# Altium schematic sheet PAGE2 -MCU.SchDoc
size A3; DocumentNumber: 1; SheetNumber: 1; SheetTotal: 2
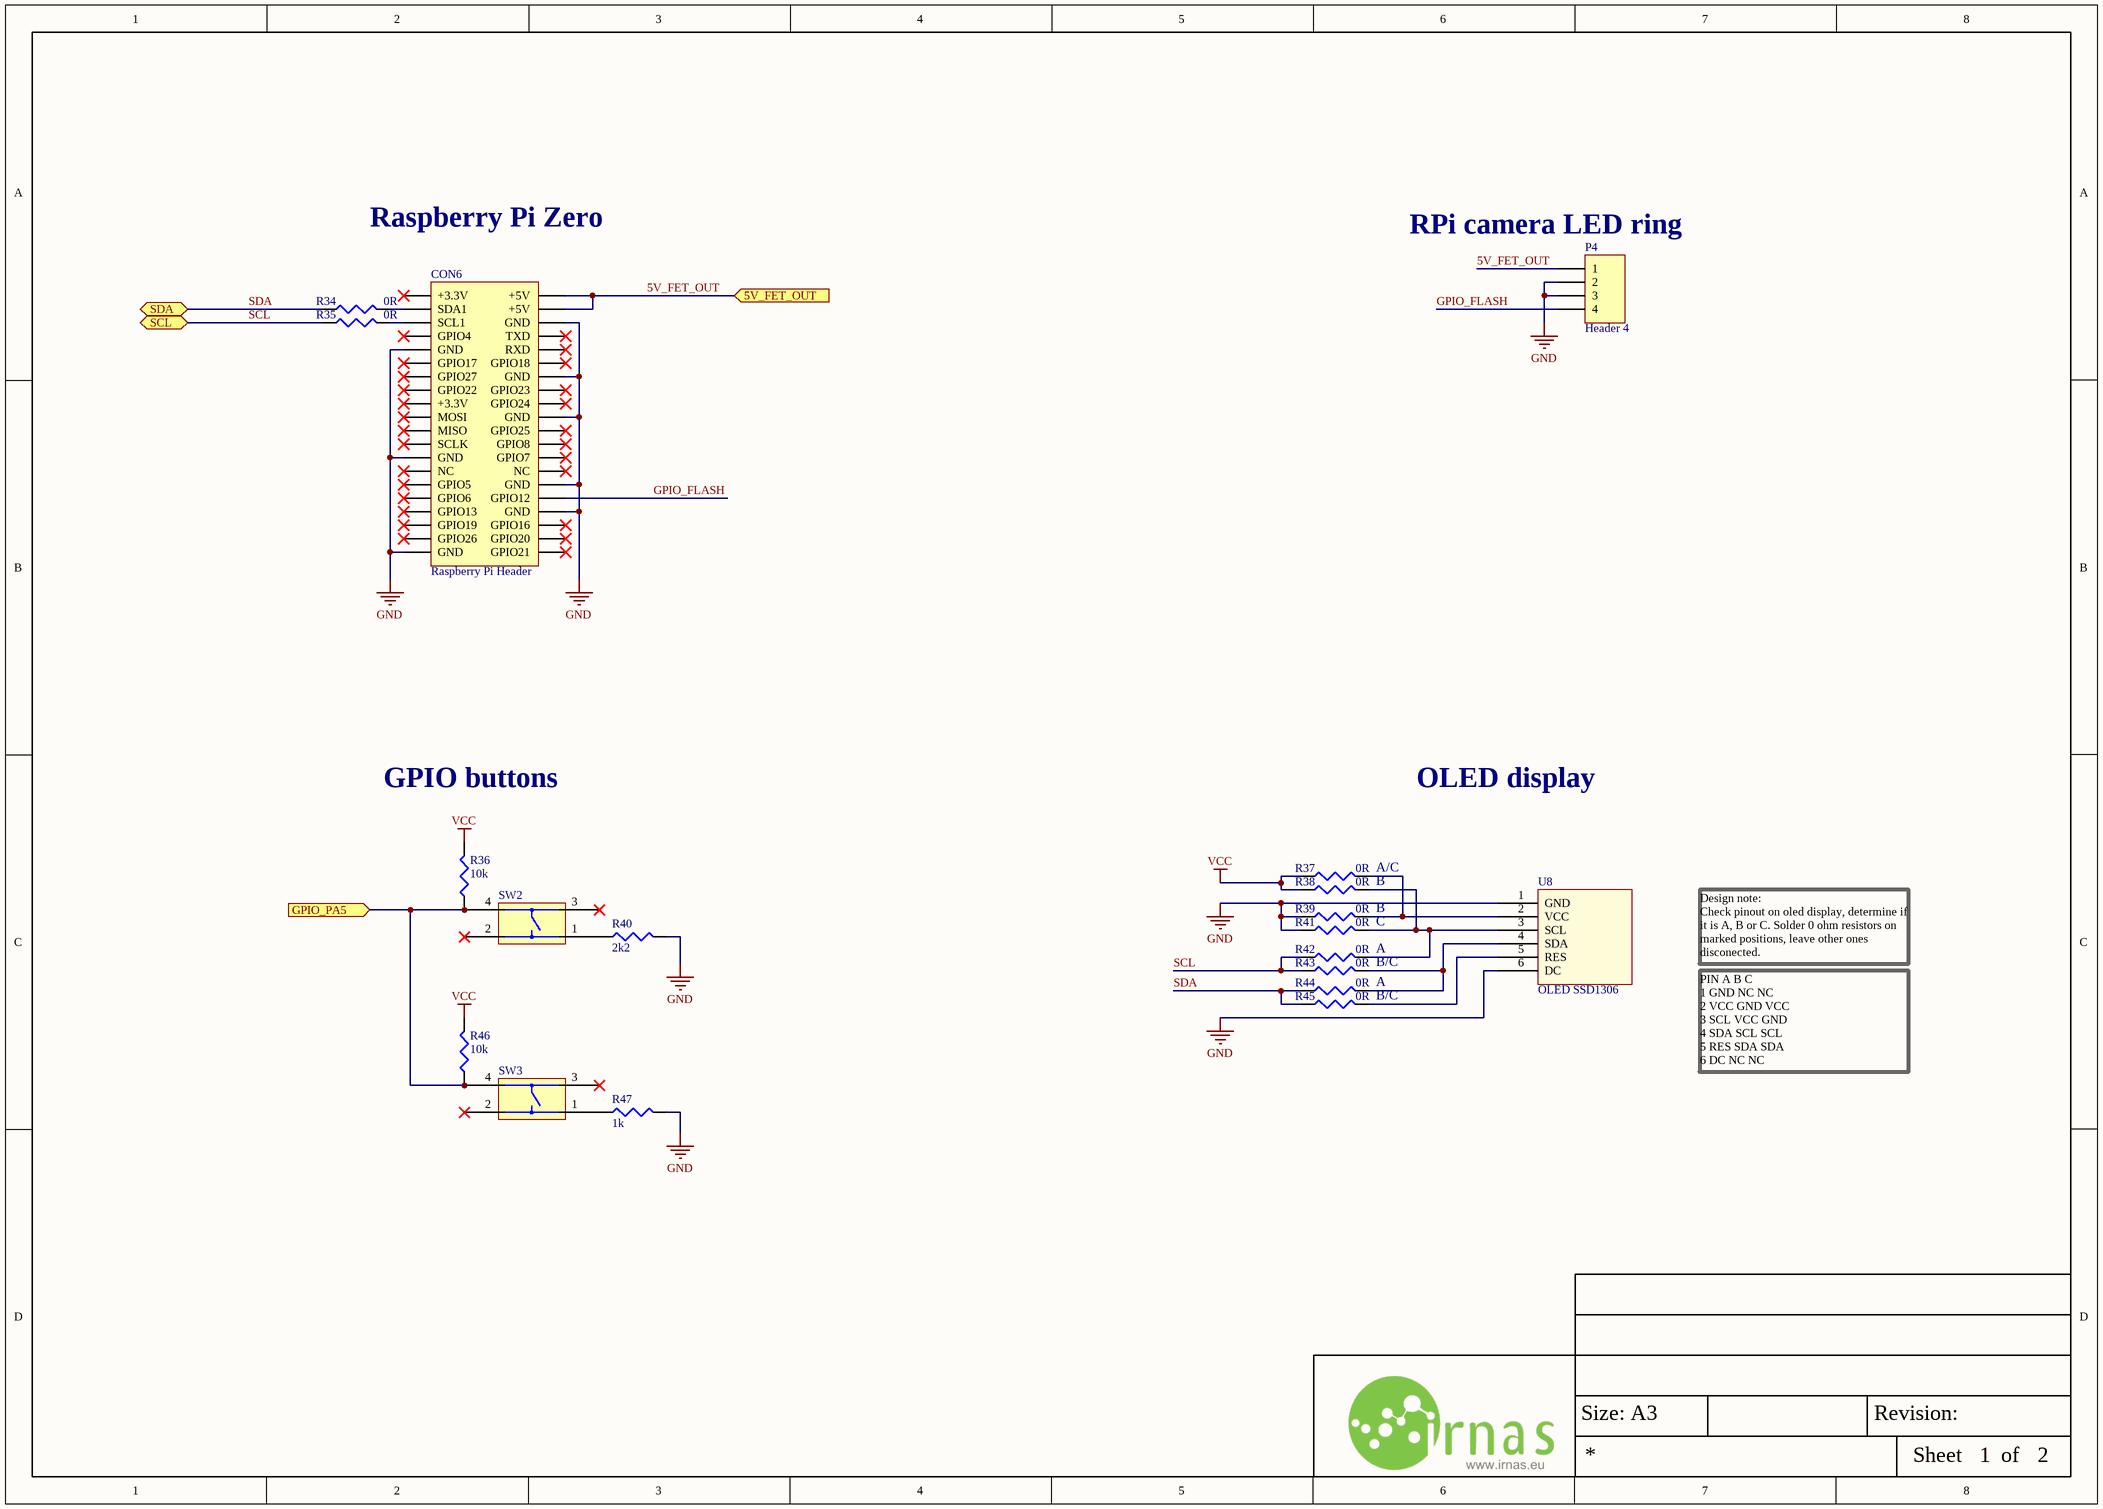
[diagram p0: PAGE2 -MCU.SchDoc]

## Parts
CON6  Raspberry Pi Header  [HDR2X20]
P4  Header 4  [HDR1X4]
R34  0R  [RES0603]
R35  0R  [RES0603]
R36  10k  [RES0603]
R37  0R  [RES0603]
R38  0R  [RES0603]
R39  0R  [RES0603]
R40  2k2  [RES0603]
R41  0R  [RES0603]
R42  0R  [RES0603]
R43  0R  [RES0603]
R44  0R  [RES0603]
R45  0R  [RES0603]
R46  10k  [RES0603]
R47  1k  [RES0603]
SW2  BTN - B3F-1070  [BTN B3F-1070]  (value not drawn)
SW3  BTN - B3F-1070  [BTN B3F-1070]  (value not drawn)
U8  OLED SSD1306  [OLED SSD1306]

## Ports
5V_FET_OUT (in), GPIO_PA5 (in), SCL (bidir), SDA (bidir)

## Nets
GND: CON6.6(GND) CON6.9(GND) CON6.14(GND) CON6.20(GND) CON6.25(GND) CON6.30(GND) CON6.34(GND) CON6.39(GND) P4.2 P4.3 R39.1 R40.2 R41.1 R47.2 U8.1(GND) U8.6(DC)
VCC: R36.2 R37.1 R38.1 R46.2
5V_FET_OUT: CON6.2(+5V) CON6.4(+5V) P4.1 ; port 5V_FET_OUT
GPIO_FLASH: CON6.32(GPIO12) P4.4
GPIO_PA5: R36.1 R46.1 SW2.4 SW3.4 ; port GPIO_PA5
SCL: R35.1 R42.1 R43.1 ; port SCL
SDA: R34.1 R44.1 R45.1 ; port SDA
NetCON6_3: CON6.3(SDA1) R34.2
NetCON6_5: CON6.5(SCL1) R35.2
NetR37_2: R37.2 R39.2 U8.2(VCC)
NetR38_2: R38.2 R41.2 R42.2 U8.3(SCL)
NetR40_1: R40.1 SW2.1
NetR43_2: R43.2 R44.2 U8.4(SDA)
NetR45_2: R45.2 U8.5(RES)
NetR47_1: R47.1 SW3.1

Not connected (* = marked no-connect by the designer): CON6 1(+3.3V)* 7(GPIO4)* 8(TXD)* 10(RXD)* 11(GPIO17)* 12(GPIO18)* 13(GPIO27)* 15(GPIO22)* 16(GPIO23)* 17(+3.3V)* 18(GPIO24)* 19(MOSI)* 21(MISO)* 22(GPIO25)* 23(SCLK)* 24(GPIO8)* 26(GPIO7)* 27(NC)* 28(NC)* 29(GPIO5)* 31(GPIO6)* 33(GPIO13)* 35(GPIO19)* 36(GPIO16)* 37(GPIO26)* 38(GPIO20)* 40(GPIO21)*; SW2 2* 3*; SW3 2* 3*

## Notes on the sheet
- Raspberry Pi Zero
- (near P4) RPi camera LED ring
- GPIO buttons
- OLED display
- A/C
- B
- C
- A
- B/C
- Design note:
  Check pinout on oled display, determine if it is A, B or C. Solder 0 ohm resistors on marked positions, leave other ones disconected.
- PIN	A	B	C
  1	GND	NC	NC
  2	VCC	GND	VCC
  3	SCL	VCC	GND
  4	SDA	SCL	SCL
  5	RES	SDA	SDA
  6	DC	NC	NC
- Size: A3
- Revision:
- Sheet
- of

## Library data of the parts
CON6 = Raspberry Pi Header: Header, 20-Pin, Dual row; LatestRevisionDate: 17-Jul-2002; LatestRevisionNote: Re-released for DXP Platform.; Publisher: Altium Limited; Supplier Part Number 1: RPi header
P4 = Header 4: Header, 4-Pin; LatestRevisionDate: 17-Jul-2002; LatestRevisionNote: Re-released for DXP Platform.; Publisher: Altium Limited; Supplier Part Number 1: Header 2.54 mm
R34 R35 R37-R39 R41-R45 = R - 0R: BOURNS - CR0603-J/-000ELF - RES, THICK FILM, 0R, 5%, 0.1W, 0603; IRNAS Part No.: I-100011; Resistance: 0; Voltage Rating: 50; Resistor Case Style: 0603 [1608 Metric]; Power Rating: 100; Product Range: CR Series; SVHC: No SVHC (17-Dec-2015); Resistor Mounting: Surface Mount Device<!--FANDB--><div class="features-and-benefits-container"><div class="features-and-benefits-description"><span class="features-benefits-value">The Bourns CR series are standard thick film chip resistors. These resistors provide flexibility of performance, space saving and low cost. The Resistance range includes E96 and E24 decade values from 1ohm to 10Mohm.</span></div><div class="features-and-benefits-list"><ul class="features-and-benefits-list-list"><li class="features-and-benefits-list-item">0201, 0402, 0603, 0805, 1206, 1210, 2010, 2512 standard case sizes available</li><li class="features-and-benefits-list-item">±1% and ±5% tolerance</li><li class="features-and-benefits-list-item">±100ppm/°C, ±200ppm/°C and ±250ppm/°C TCR values available</li><li class="features-and-benefits-list-item">Power rating selectable for 50mW, 63mW, 0.1W, 0.125W, 0.25W, 0.5W and 1W based on ordering</li><li class="features-and-benefits-list-item">Jumpers are available for all size</li><li class="features-and-benefits-list-item">3 layer termination process with nickel barrier prevents leaching & provides excellent solderability</li><li class="features-and-benefits-list-item">Suitable for all type of soldering processes</li><li class="features-and-benefits-list-item">Tight dimensional tolerances</li><li class="features-and-benefits-list-item">Maximum working voltage depends on case size</li><li class="features-and-benefits-list-item">Operating temperature of -55°C to +125°C(CR0201) and -55°C to +155; Supplier 1: Farnell; Manufacturer: BOURNS; Manufacturer Part Number: CR0603-J/-000ELF; RoHS: YES; Stock 1: 58200; Pricing 1: 10=0.0146, 250=0.0097, 1000=0.0073, 5000=0.0049, 12500=0.0042 (GBP); Resistance Tolerance: ± 5%; Packaging: Cut Tape; Resistor Element Material: Thick Film; Temperature Coefficient: -; Automotive Qualification Standard: -; MSL: MSL 1 - Unlimited; ComponentLink1URL: http://www.bourns.com/engineering/CHPREZTR/cr0603.stp; ComponentLink1Description: http://www.bourns.com/engineering/CHPREZTR/cr0603.stp; ComponentLink2URL: http://www.farnell.com/datasheets/2178762.pdf; ComponentLink2Description: http://www.farnell.com/datasheets/2178762.pdf; Supplier Part Number 1: 2008343
R36 R46 = R - 10k: MULTICOMP - MCMR06X103 JTL - RES, CERAMIC, 10K, 5%, 0.1W, 0603; IRNAS Part No.: I-100008; Resistance: 10; Voltage Rating: 75; Resistor Case Style: 0603 [1608 Metric]; Power Rating: 100; Product Range: MCMR Series; Temperature Coefficient: ± 100; Automotive Qualification Standard: -<!--FANDB--><div class="features-and-benefits-container"><div class="features-and-benefits-description"><span class="features-benefits-value">The Multicomp MCMR series resistors are automotive grade, anti sulphured thick film chip resistor. The resistance range includes E24 and E96 decade values from 1ohm to 10Mohm. These resistors are constructed on top of a high grade ceramic body.</span></div><div class="features-and-benefits-list"><ul class="features-and-benefits-list-list"><li class="features-and-benefits-list-item">EIA 0402, 0603, 0805, 1206 chip sizes available</li><li class="features-and-benefits-list-item">High reliability and stability</li><li class="features-and-benefits-list-item">Automotive grade AEC-Q200 compliant</li><li class="features-and-benefits-list-item">Complaint with (IEC 60068-1) 55/155/56 climatic category</li><li class="features-and-benefits-list-item">Maximum operation voltage of 50V, 75V, 150V and 200V</li><li class="features-and-benefits-list-item">Power rating of 62.5mW, 100mW, 125mW and 250mW</li><li class="features-and-benefits-list-item">Available in ±1% and ±5% tolerance</li><li class="features-and-benefits-list-item">Temperature coefficient (TCR) of +200ppm/°C, +100ppm/°C and -200ppm/°C to +400ppm/°C</li><li class="features-and-benefits-list-item">Operating temperature range -55°C to 155; Supplier 1: Farnell; Manufacturer: MULTICOMP; Manufacturer Part Number: MCMR06X103 JTL; RoHS: Y-EX; Stock 1: 19791; Pricing 1: 10=0.0087, 100=0.0074, 500=0.0061, 1000=0.0048, 2500=0.0032, 5000=0.0024, 25000=0.0016, 50000=0.0013 (GBP); Resistance Tolerance: ± 5%; Packaging: Cut Tape; Resistor Element Material: Ceramic; ComponentLink1URL: http://www.farnell.com/datasheets/1716707.pdf; ComponentLink1Description: http://www.farnell.com/datasheets/1716707.pdf; Supplier Part Number 1: 2073356
R40 = R - 2k2: MULTICOMP - MCMR06X2201FTL - RES, CERAMIC, 2K2, 1%, 0.1W, 0603; IRNAS Part No.: I-100024; Supplier 1: Farnell; Manufacturer: MULTICOMP; Manufacturer Part Number: MCMR06X2201FTL; RoHS: Y-EX; Stock 1: 17638; Pricing 1: 10=0.0099, 100=0.0059, 500=0.0042, 1000=0.0033, 2500=0.0027 (GBP); ComponentLink1URL: http://www.farnell.com/datasheets/1716707.pdf; ComponentLink1Description: http://www.farnell.com/datasheets/1716707.pdf; Supplier Part Number 1: 2073429
R47 = R - 1k: MULTICOMP - MCMR06X102 JTL - RES, CERAMIC, 1K, 5%, 0.1W, 0603; IRNAS Part No.: I-100042; Resistance: 1; Voltage Rating: 75; Resistor Case Style: 0603 [1608 Metric]; Power Rating: 100; Product Range: MCMR Series; Temperature Coefficient: ± 100; Resistor Mounting: Surface Mount Device<!--FANDB--><div class="features-and-benefits-container"><div class="features-and-benefits-description"><span class="features-benefits-value">The Multicomp MCMR series resistors are automotive grade, anti sulphured thick film chip resistor. The resistance range includes E24 and E96 decade values from 1ohm to 10Mohm. These resistors are constructed on top of a high grade ceramic body.</span></div><div class="features-and-benefits-list"><ul class="features-and-benefits-list-list"><li class="features-and-benefits-list-item">EIA 0402, 0603, 0805, 1206 chip sizes available</li><li class="features-and-benefits-list-item">High reliability and stability</li><li class="features-and-benefits-list-item">Automotive grade AEC-Q200 compliant</li><li class="features-and-benefits-list-item">Complaint with (IEC 60068-1) 55/155/56 climatic category</li><li class="features-and-benefits-list-item">Maximum operation voltage of 50V, 75V, 150V and 200V</li><li class="features-and-benefits-list-item">Power rating of 62.5mW, 100mW, 125mW and 250mW</li><li class="features-and-benefits-list-item">Available in ±1% and ±5% tolerance</li><li class="features-and-benefits-list-item">Temperature coefficient (TCR) of +200ppm/°C, +100ppm/°C and -200ppm/°C to +400ppm/°C</li><li class="features-and-benefits-list-item">Operating temperature range -55°C to 155; Supplier 1: Farnell; Manufacturer: MULTICOMP; Manufacturer Part Number: MCMR06X102 JTL; RoHS: Y-EX; Stock 1: 18133; Pricing 1: 10=0.0089, 100=0.0076, 500=0.0063, 1000=0.0049, 2500=0.0033, 5000=0.0024, 25000=0.0016, 50000=0.0013 (GBP); Resistance Tolerance: ± 5%; Packaging: Cut Tape; Resistor Element Material: Ceramic; Automotive Qualification Standard: -; ComponentLink1URL: http://www.farnell.com/datasheets/1716707.pdf; ComponentLink1Description: http://www.farnell.com/datasheets/1716707.pdf; Supplier Part Number 1: 2073354
SW2 SW3 = BTN - B3F-1070: Tactile Switch, B3F Series, Top Actuated, Through Hole, Round Button, 100 gf, 50mA at 24VDC; ComponentLink1Description: Datasheet; ComponentLink1URL: https://4donline.ihs.com/images/VipMasterIC/IC/OMRN/OMRN-S-A0001309768/OMRN-S-A0001309768-1.pdf?hkey=52A5661711E402568146F3353EA87419; Supplier 1: Farnell; Supplier Part Number 1: 959698
U8 = OLED SSD1306: Supplier Part Number 1: OLED SSD 1306 display